# EAGLE design EC_Reader_v10 (EAGLE 7.2.0)
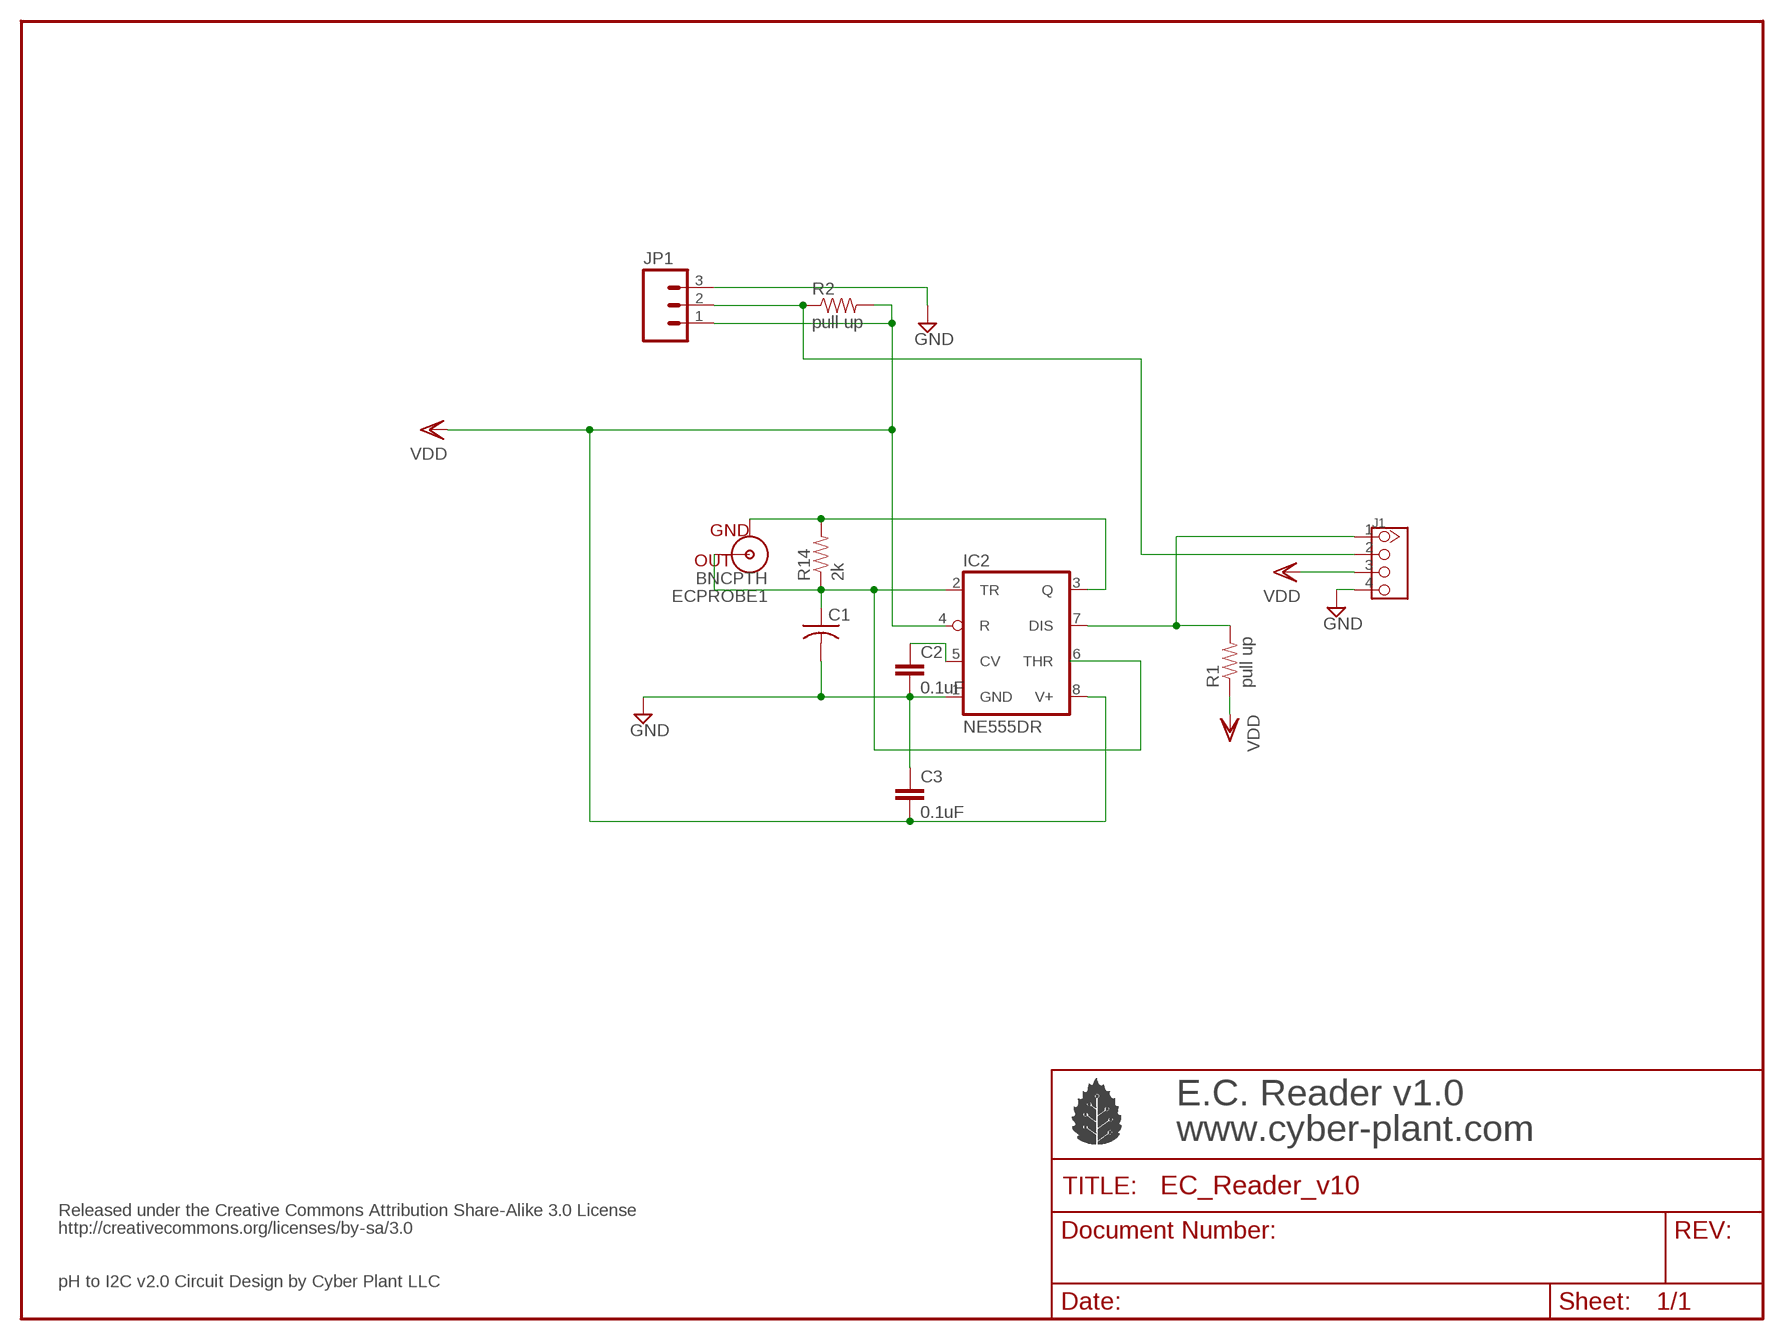
[diagram p0: schematic, sheet 1]

## Parts
C1  C-US050-045X075  [C050-045X075]
C2  0.1uF  CAP1206  [1206]
C3  0.1uF  CAP1206  [1206]
ECPROBE1  BNCPTH  [BNC]
IC2  NE555DR  LM555D  [SO08]
J1  TWIG-4P-2.090D  [4P-2.0-90D]
JP1  M03PTH  [1X03]
R1  pull up  RESISTORPTH-1/4W  [AXIAL-0.4]
R2  pull up  RESISTORPTH-1/4W  [AXIAL-0.4]
R14  2k  RESISTOR1206  [1206]

## Nets
GND: C1.2 C2.2 C3.1 IC2.1(GND) J1.4 JP1.3
N$1: J1.2 JP1.2 R2.P$1
N$16: IC2.7(DIS) J1.1 R1.P$2
N$21: C1.1 ECPROBE1.S(OUT) IC2.2(TR) IC2.6(THR) R14.1
N$23: ECPROBE1.GND IC2.3(Q) R14.2
N$26: C2.1 IC2.5(CV)
VDD: C3.2 IC2.4(R) IC2.8(V+) J1.3 JP1.1 R1.P$1 R2.P$2

## Notes on the sheet
- E.C. Reader v1.0
- www.cyber-plant.com
- Released under the Creative Commons Attribution Share-Alike 3.0 License
- http://creativecommons.org/licenses/by-sa/3.0
- pH to I2C v2.0 Circuit Design by Cyber Plant LLC

## Library data of the parts
C1 = adafruit:C-US: CAPACITOR, American symbol
C2 C3 = SparkFun:CAP: Capacitor Standard 0603 ceramic capacitor, and 0.1" leaded capacitor.
ECPROBE1 = SparkysWidgets:BNC: BNC Connector, Mouser Part# 5227161
IC2 = adafruit:*555: TIMER Changed DIP package to have round (not oval) pin pads http://www.ladyada.net/library/pcb/eaglelibrary.html
J1 = Connector_cp:TWIG-4P-2.0
JP1 = SparkFun:M03: Header 3 Standard 3-pin 0.1" header. Use with straight break away headers (SKU : PRT-00116), right angle break away headers (PRT-00553), swiss pins (PRT-00743), machine pins (PRT-00117), and female headers (PRT-00115). Molex polarized connector foot print use with SKU : PRT-08232 with associated crimp pins and housings.
R1 R2 = SparkFun:RESISTOR: Resistor Basic schematic elements and footprints for 0603, 1206, and PTH resistors.
R14 = SparkFun:RESISTOR: Resistor Basic schematic elements and footprints for 0603, 1206, and PTH resistors.; PROD_ID: RES-00824

## Board
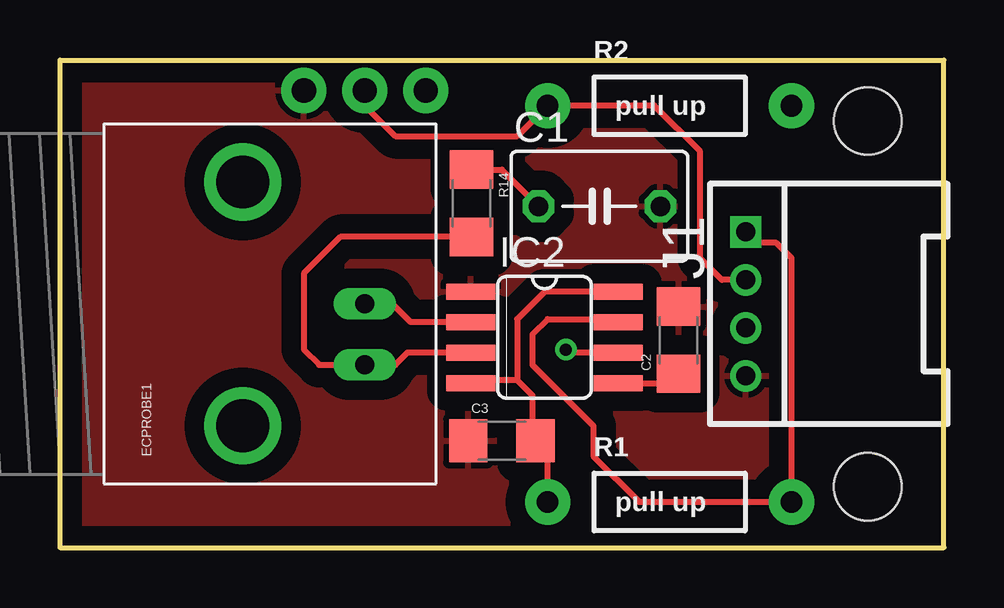
[diagram p1: board, top side]
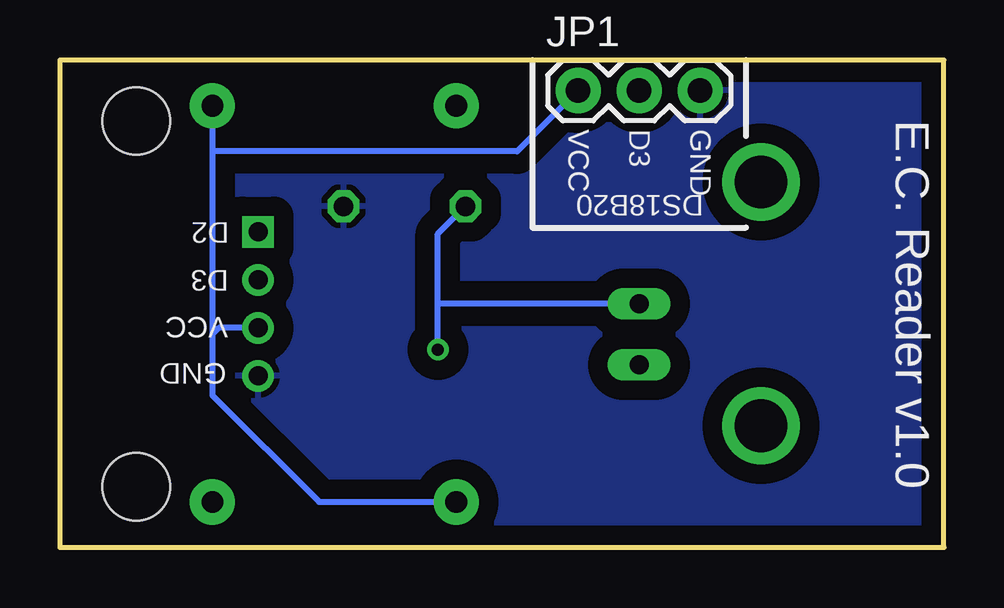
[diagram p2: board, bottom side, seen from below]

Size 36.83 x 20.32 mm. Coordinates in mm from the lower left corner, seen from the top.
Outline: 36.83,0 36.83,20.32 0,20.32 0,0 36.83,0
Copper layers (1*16): Top 0.035mm / dielectric 1.5mm / Bottom 0.035mm
Design rules "default *": minimum track width 6mil, minimum drill 12mil, track to track 10mil, track to pad 10mil, pad to pad 10mil, via to via 10mil, smd to smd 10mil, copper to edge 10mil, drill to drill 12mil, minimum pad ring 10mil, minimum via ring 8mil, stop-mask expansion 4mil, vias tented up to drill 20mil, thermal gap 10mil
Holes 2.8 mm at 33.66,2.54 33.66,17.78

### Footprints (pad centres in the part's own frame; a part is rotated, then mirrored left to right if it is on the bottom)
C050-045X075 = drill 0.813 octagon: 1 -2.54,0; 2 2.54,0
1206 = smd 1.6 x 1.8: 1 -1.4,0; 2 1.4,0
BNC = drill 2.2: 3 -5.08,5.08; 4 5.08,5.08 | drill 0.8 long: GND -2.54,0; S 0,0
SO08 = smd 0.66 x 2.032: 1 -1.905,-3.073; 2 -0.635,-3.073; 3 0.635,-3.073; 4 1.905,-3.073; 5 1.905,3.073; 6 0.635,3.073; 7 -0.635,3.073; 8 -1.905,3.073
4P-2.0-90D = drill 0.8 pad 1.27 square: 1 -3,0 | drill 0.8 pad 1.27: 2 -1,0; 3 1,0; 4 3,0
1X03 = drill 1.016 pad 1.88: 1 0,0; 2 2.54,0; 3 5.08,0
AXIAL-0.4 = drill 0.9 pad 1.88: P$1 -5.08,0; P$2 5.08,0

### Placement (x,y rotation side)
C1  22.47,14.23 0 top
C2  25.77,8.65 90 top
C3  18.41,4.46 0 top
ECPROBE1  12.7,10.16 90 top
IC2  20.19,8.76 270 top
J1  28.57,10.16 270 top
JP1  15.24,19.05 0 bottom
R1  25.4,1.9 0 top
R2  25.4,18.41 0 top
R14  17.14,14.35 270 top

### Tracks (layer width: path | path; a pad name or v marks a point on that pad's centre or on a via)
GND
  pour Top (isolate 0.813): 0,20.32 0,0 36.83,0 36.83,20.32
  pour Bottom (isolate 0.813): 0,0 0,20.32 36.83,20.32 36.83,0
N$1
  Top 0.254: J1.2 27.57,11.16 26.67,12.06 26.67,16.51 24.76,18.41 R2.P$1 19.05,17.14 13.97,17.14 12.7,18.41 JP1.2
N$16
  Top 0.254: J1.1 29.04,12.7 29.84,12.7 30.48,12.06 R1.P$2 24.13,1.9 22.22,3.81 22.22,5.08 19.68,7.62 19.68,8.89 20.32,9.52 23.13,9.52 IC2.7 22.35,9.4
N$21  (via drill 0.5)
  Top 0.254: R14.1 18.41,15.75 C1.1 | IC2.2 14.61,9.4 13.84,10.16 ECPROBE1.S | IC2.6 21.21,8.13 v21.08,8.25
  Bottom 0.254: v21.08,8.25 21.08,10.16 | 21.08,10.16 21.08,13.08 C1.1 | ECPROBE1.S 21.08,10.16
N$23
  Top 0.254: IC2.3 14.48,8.13 13.97,7.62 ECPROBE1.GND 10.79,7.62 10.16,8.25 10.16,11.43 11.68,12.95 R14.2
N$26
  Top 0.254: IC2.5 25.38,6.86 C2.1
VDD
  Top 0.254: IC2.8 20.19,10.67 19.05,9.52 19.05,6.98 | 19.05,6.98 17.24,6.98 IC2.4 | 19.05,6.98 19.68,6.35 19.68,4.58 C3.2 20.32,3.95 R1.P$1
  Bottom 0.254: R2.P$2 30.48,16.51 | 30.48,16.51 30.48,8.89 | 30.48,8.89 30.48,6.35 26.04,1.9 R1.P$1 | JP1.1 17.78,16.51 30.48,16.51 | J1.3 30.21,9.16 30.48,8.89

### Text on the board
bPlace: GND | D3 | VCC | DS18B20 | D2 | D3 | E.C. Reader v1.0 | VCC | GND
_tsilk: JP5 | JP4 | GND | CN3 | Pump 2 | Pump 1 | TX | RX | BLA / BLK | CN2 | Enable | 16 | D9 / D8 | ISP | CN1 | 1X4-BIG | 10k | R6 | FDS6630A | Q2 | D7 / D6 | 1X4-BIG | Disable | N/A | SCLK / SCK | SDO / MISO | SDI / MOSI | CSB / SS | LCD Module | 1X4-BIG | 1M | R7 | N/A | FDS6630A | Q1 | D5 / GND | 100R for Pt100 | 1K for Pt1000 | 10k | R8 | D4 / GND | R1 | R9 | D1 | D7 | 5V / GND | 1 | 1M | MBRA140 | MBRA140 | JP2 | 10k | CyberPlant | R11 | FSMCD | Pump 1 | RTD2 | pH Corrector Shield v3.0 | S3 | GND | IC1 | 4.3K | R5 | 10k | Vin | LMP2 | R4 | 1.3K | LMP91200_PW_16 | R10 | FSMCD | 680R | 2K | GND | CN6 | R3 | R2 | S1 | 5V | S4 | CN5 | FSMCD | Vin | J1 | GND | CN4 | Pump 2 | BNC | Analog | A1 | A2 | A3 | JP1 | 5V | GND | VIN | JP3 | SDA | SCL | S2 | FSMCD | BNC2